# EAGLE design 1593K-WirelessTallyReceiver (EAGLE 9.4.2)
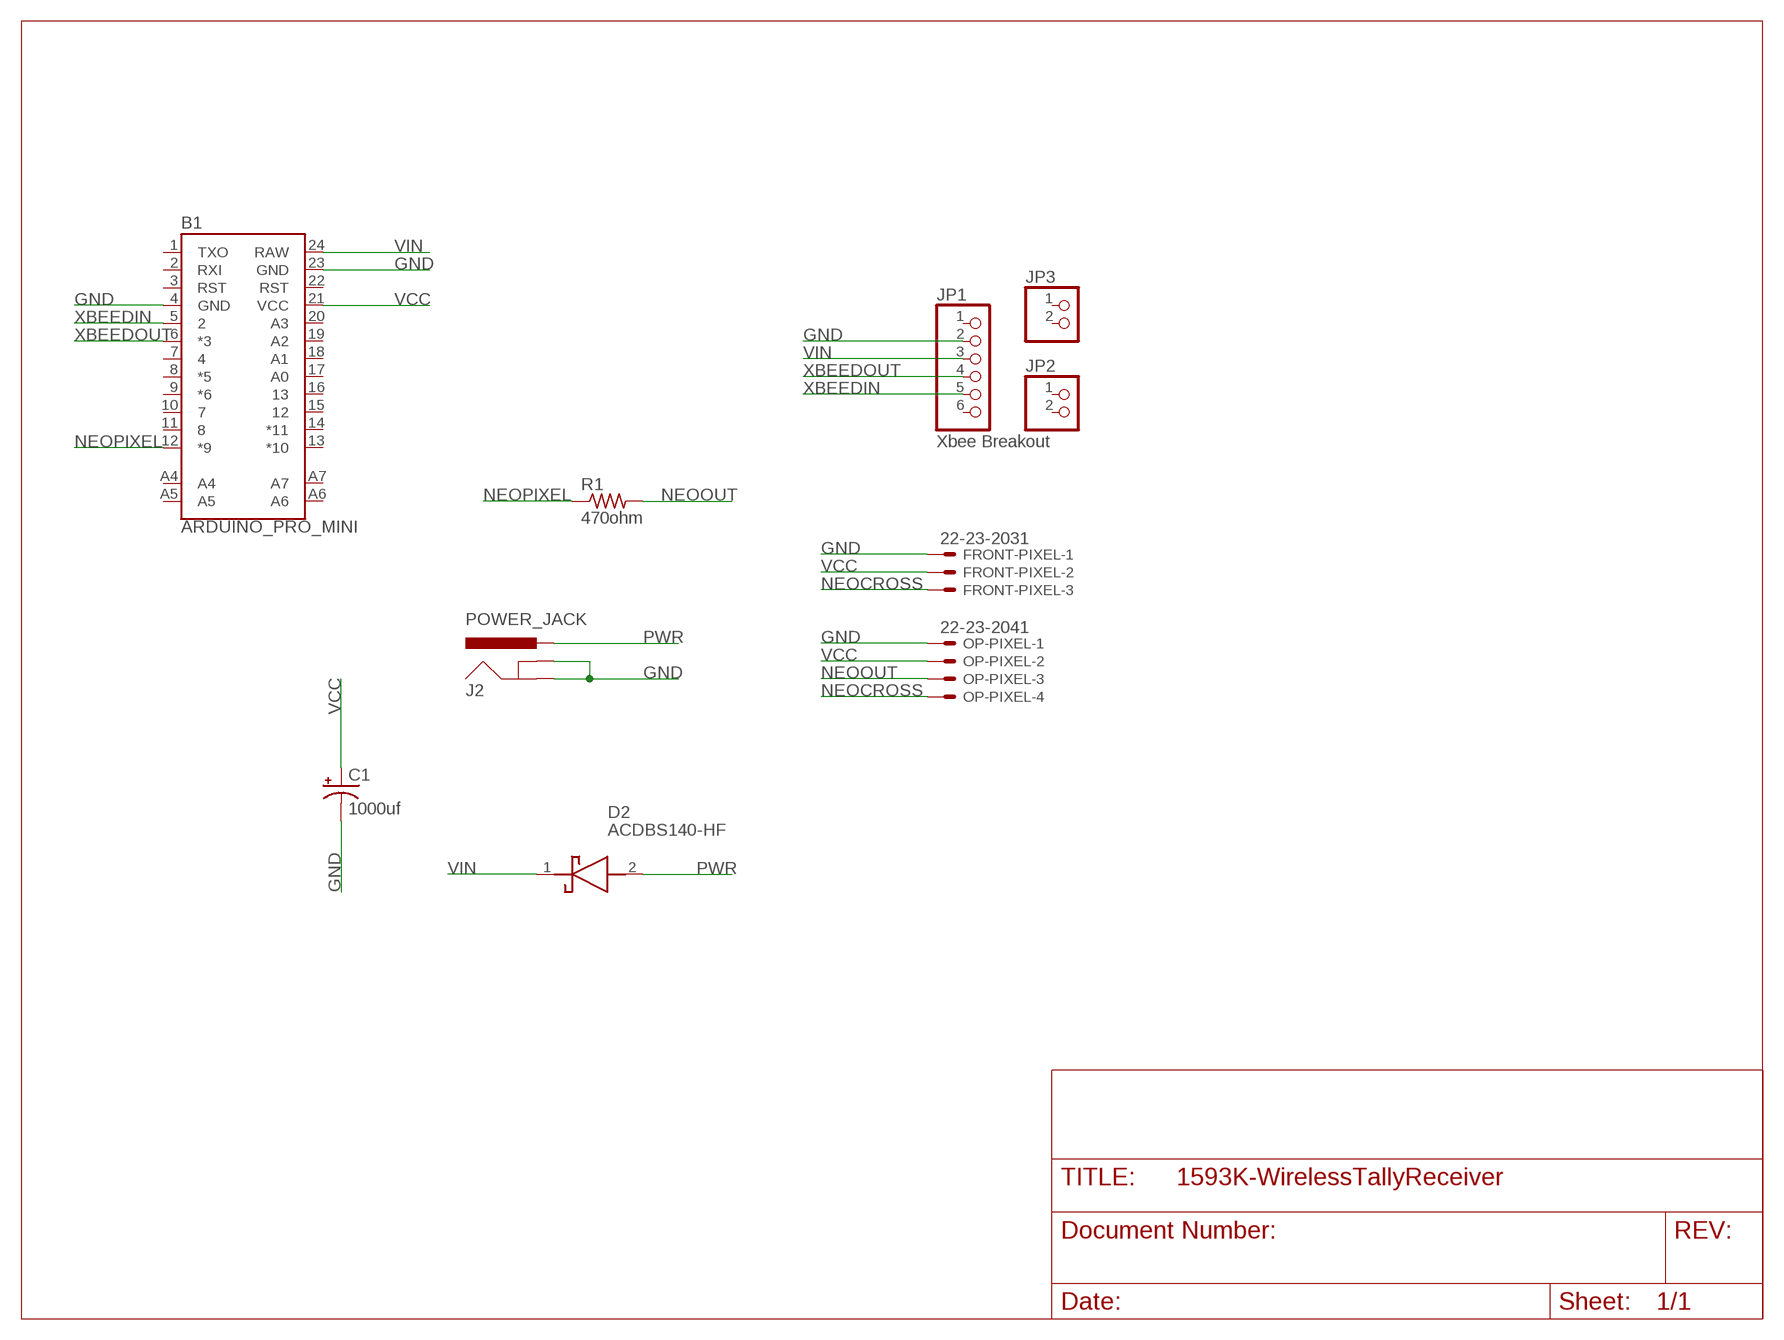
[diagram p0: schematic, sheet 1]

## Parts
B1  ARDUINO_PRO_MINI  [ARDUINO_PRO_MINI]
C1  1000uf  1000UF-RADIAL-5MM-25V-20%  [CPOL-RADIAL-5MM-10MM]
D2  ACDBS140-HF  [DIOM2013X100N]
FRONT-PIXEL  22-23-2031  [22-23-2031]
J2  POWER_JACK  [POWER_JACK_PTH]
JP1  Xbee Breakout  PINHD-1X6  [1X06]
JP2  PINHD-1X2  [1X02]
JP3  PINHD-1X2  [1X02]
OP-PIXEL  22-23-2041  [22-23-2041]
R1  470ohm  R-US_R0805  [R0805]

## Nets
GND: B1.4(GND) B1.23(GND) C1.- FRONT-PIXEL.1 J2.GND J2.GNDBREAK JP1.2 OP-PIXEL.1
NEOCROSS: FRONT-PIXEL.3 OP-PIXEL.4
NEOOUT: OP-PIXEL.3 R1.2
NEOPIXEL: B1.12(*9) R1.1
PWR: D2.2(A) J2.PWR
VCC: B1.21(VCC) C1.+ FRONT-PIXEL.2 OP-PIXEL.2
VIN: B1.24(RAW) D2.1(K) JP1.3
XBEEDIN: B1.5 JP1.5
XBEEDOUT: B1.6(*3) JP1.4
Unconnected: B1.1(TXO) B1.2(RXI) B1.3(RST) B1.7 B1.8(*5) B1.9(*6) B1.10 B1.11 B1.13(*10) B1.14(*11) B1.15 B1.16 B1.17(A0) B1.18(A1) B1.19(A2) B1.20(A3) B1.22(RST) B1.A4 B1.A5 B1.A6 B1.A7 JP1.1 JP1.6 JP2.1 JP2.2 JP3.1 JP3.2

## Library data of the parts
B1 = SparkFun-Boards:ARDUINO_PRO_MINI: SparkFun Pro Mini Pro Mini compatible footprint. Dimensions: 0.7 x 1.3" PCB Thickness: 0.8mm SparkFun Products: 3.3V/8MHz <https://www.sparkfun.com/products/11114> 5V/16MHz <https://www.sparkfun.com/products/11113>
C1 = SparkFun-Capacitors:1000UF: 1,000µF/1mF ceramic capacitors A capacitor is a passive two-terminal electrical component used to store electrical energy temporarily in an electric field. CAP-08070; PROD_ID: CAP-09538; VALUE: 1mF
D2 = SamacSys_Parts:ACDBS140-HF: Schottky Diodes & Rectifiers 40V 1A 0805 Source: Datasheet <https://componentsearchengine.com/Datasheets/1/ACDBS140-HF.pdf>; DESCRIPTION: Schottky Diodes & Rectifiers 40V 1A 0805; HEIGHT: 1mm; MANUFACTURER_NAME: Comchip Technology; MANUFACTURER_PART_NUMBER: ACDBS140-HF; MOUSER_PART_NUMBER: 750-ACDBS140-HF; MOUSER_PRICE-STOCK: https://www.mouser.com/Search/Refine.aspx?Keyword=750-ACDBS140-HF
FRONT-PIXEL = con-molex:22-23-2031: .100" (2.54mm) Center Header - 3 Pin; MF: MOLEX; MPN: 22-23-2031; OC_FARNELL: 1462950; OC_NEWARK: 30C0862
J2 = SparkFun-Connectors:POWER_JACK: Power Jack Connector This is the standard 5.5mm barrel jack for power. The PTH is the most common, proven, reliable, footprint. The Slot footprint only works if the mill layer is transmitted to the PCB fab house so be warned. Here are the connectors we sell at SparkFun: DC Barrel Power Jack/Connector <https://www.sparkfun.com/products/119> (PRT-00119) DC Barrel Power Jack/Connector (SMD) <https://www.sparkfun.com/products/12748> (PRT-12748) DC Barrel Jack Adapter - Breadboard Compatible <https://www.sparkfun.com/products/10811> (PRT-10811) It is used on this SparkFun product (and many, many others): SparkFun RedBoard - Programmed with Arduino <https://www.sparkfun.com/products/12757> (DEV-12757) Also, if you need a mating power supply or connector, please check these out: Wall Adapter Power Supply - 9VDC 650mA <https://www.sparkfun.com/products/298> (TOL-00298) DC Barrel Jack Adapter - Male <https://www.sparkfun.com/products/10287> (PRT-10287); PROD_ID: CONN-08197
JP1 = pinhead:PINHD-1X6: PIN HEADER
JP2 JP3 = pinhead:PINHD-1X2: PIN HEADER
OP-PIXEL = con-molex:22-23-2041: .100" (2.54mm) Center Header - 4 Pin; MF: MOLEX; MPN: 22-23-2041; OC_FARNELL: 1462920; OC_NEWARK: 38C0355
R1 = rcl:R-US_: RESISTOR, American symbol; SPICEPREFIX: R

## Board
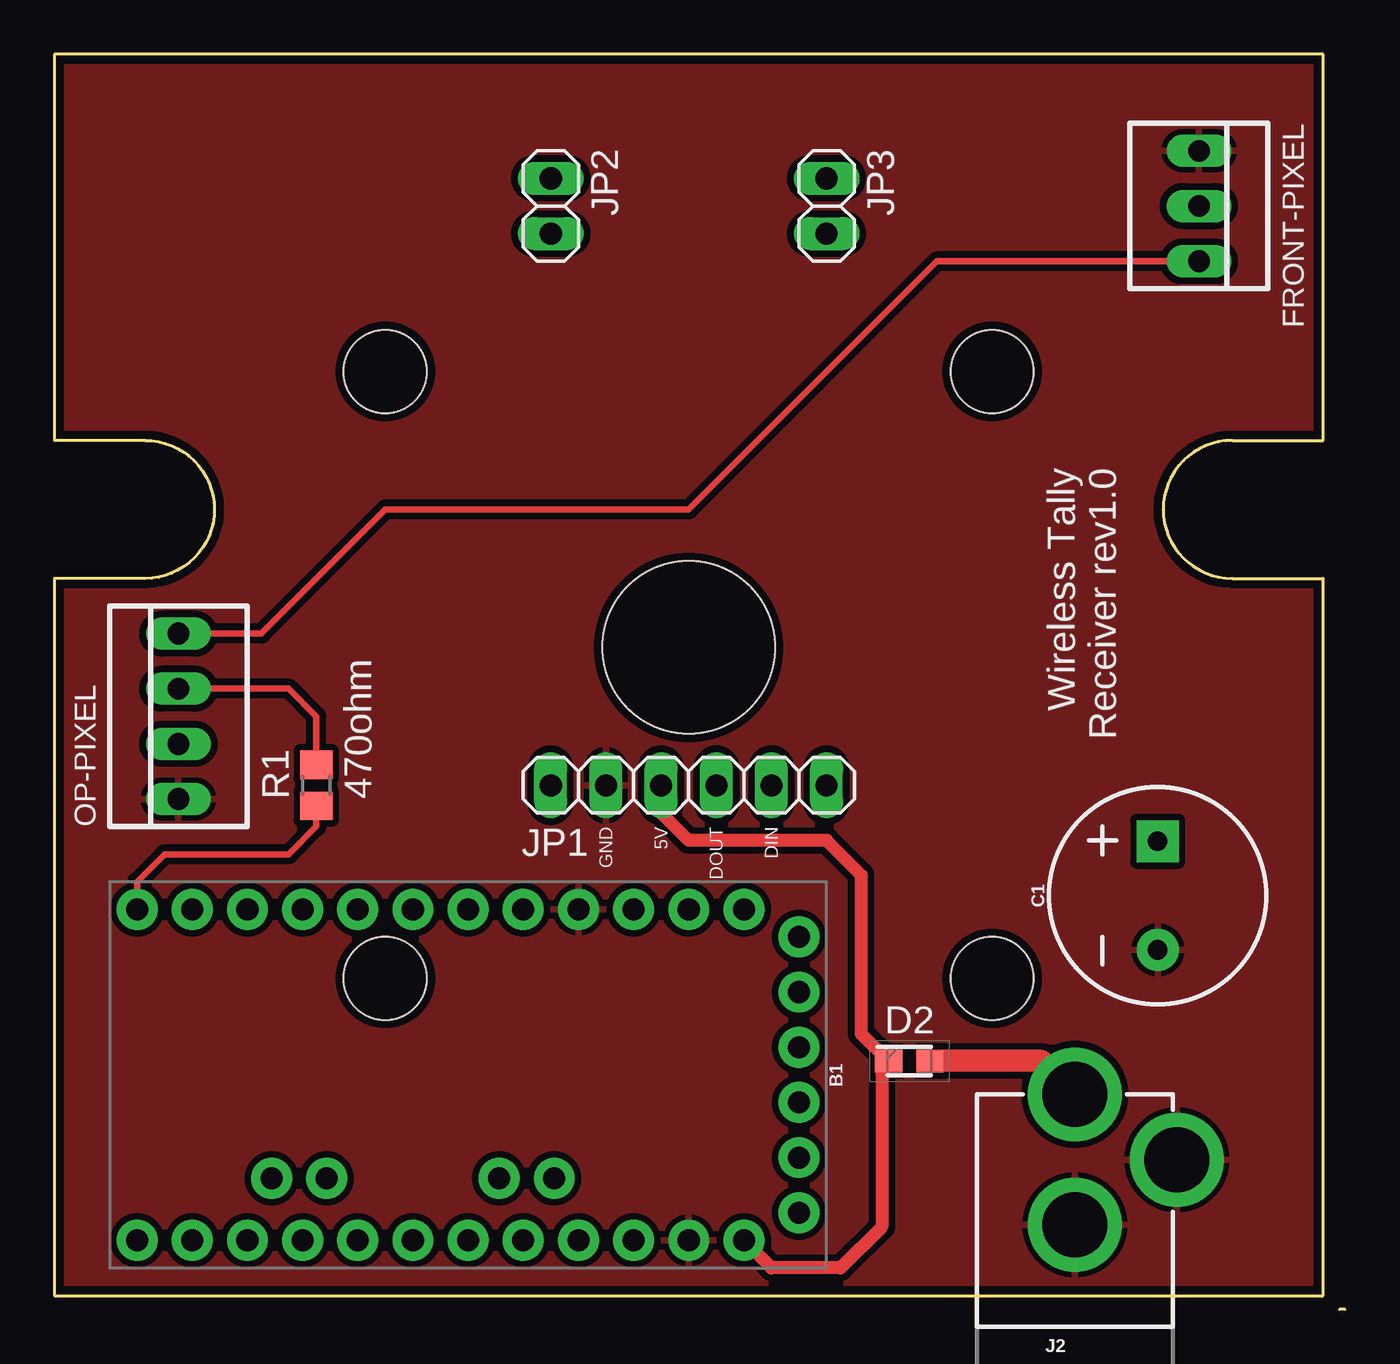
[diagram p1: board, top side]
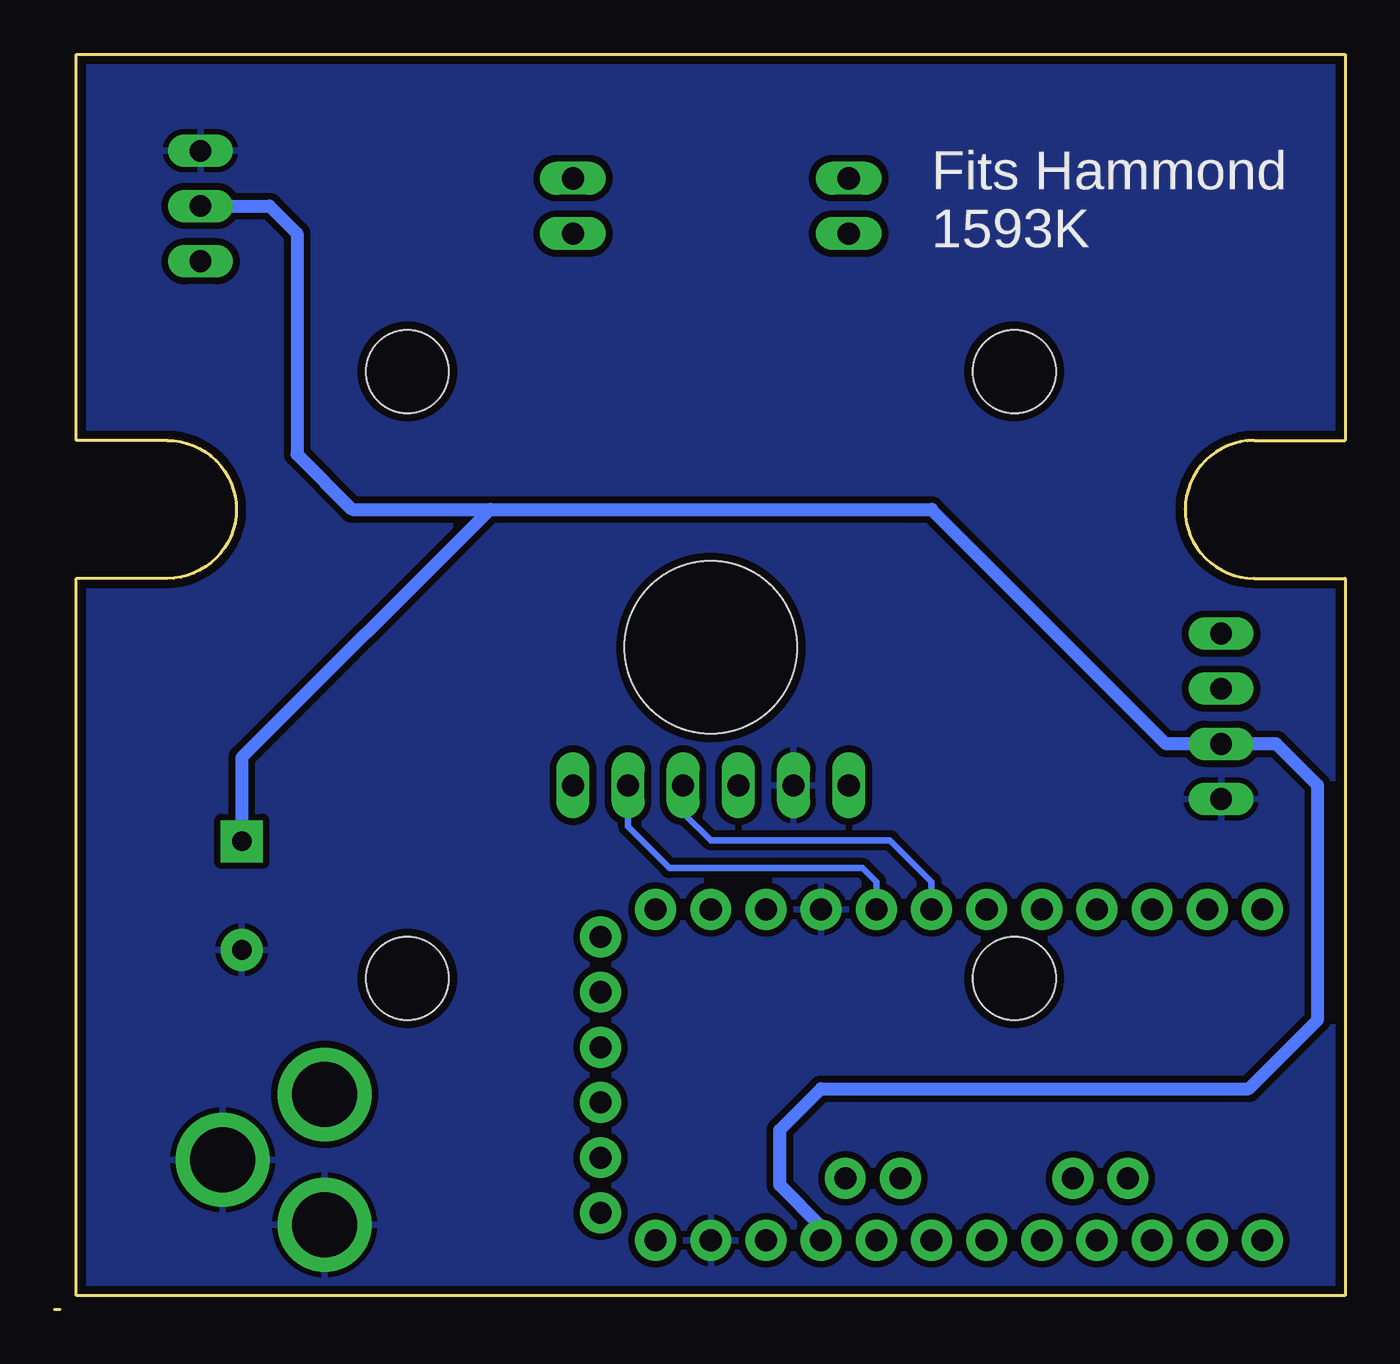
[diagram p2: board, bottom side, seen from below]

Size 59.44 x 57.78 mm. Coordinates in mm from the lower left corner, seen from the top.
Copper layers (1*16): Top 0.035559375mm / dielectric 1.6mm / Bottom 0.035559375mm
Design rules "default": minimum track width 6mil, minimum drill 10mil, track to track 6mil, track to pad 6mil, pad to pad 6mil, via to via 6mil, smd to smd 6mil, copper to edge 15mil, drill to drill 6mil, minimum pad ring 5mil, minimum via ring 5mil, stop-mask expansion 2.5mil, vias tented up to drill 0mil, thermal gap 10mil
Holes 7.94 mm at 29.21,30.48

### Footprints (pad centres in the part's own frame; a part is rotated, then mirrored left to right if it is on the bottom)
ARDUINO_PRO_MINI = drill 1.016 pad 1.88: 1 -7.62,12.7; 2 -7.62,10.16; 3 -7.62,7.62; 4 -7.62,5.08; 5 -7.62,2.54; 6 -7.62,0; 7 -7.62,-2.54; 8 -7.62,-5.08; 9 -7.62,-7.62; 10 -7.62,-10.16; 11 -7.62,-12.7; 12 -7.62,-15.24; 13 7.62,-15.24; 14 7.62,-12.7; 15 7.62,-10.16; 16 7.62,-7.62; 17 7.62,-5.08; 18 7.62,-2.54; 19 7.62,0; 20 7.62,2.54; 21 7.62,5.08; 22 7.62,7.62; 23 7.62,10.16; 24 7.62,12.7; A4 4.763,1.429; A5 4.763,3.969; A6 4.763,-9.049; A7 4.763,-6.509; BLK -6.35,15.24; GND -3.81,15.24; GRN 6.35,15.24; RXI 1.27,15.24; TXO 3.81,15.24; VCC -1.27,15.24
CPOL-RADIAL-5MM-10MM = drill 0.9 pad 1.93 square: + 2.5,0 | drill 0.9 pad 1.93: - -2.5,0
DIOM2013X100N = smd 1.25 x 1.05: 1 -0.95,0; 2 0.95,0
22-23-2031 = drill 1 long: 1 -2.54,0; 2 0,0; 3 2.54,0
POWER_JACK_PTH = drill 2.997 pad 4.318: GND 0,7.7; GNDBREAK 4.7,10.7; PWR 0,13.7
1X06 = drill 1.016 long: 1 -6.35,0; 2 -3.81,0; 3 -1.27,0; 4 1.27,0; 5 3.81,0; 6 6.35,0
1X02 = drill 1.016 long: 1 -1.27,0; 2 1.27,0
22-23-2041 = drill 1 long: 1 -3.81,0; 2 -1.27,0; 3 1.27,0; 4 3.81,0
R0805 = smd 1.3 x 1.5: 1 -0.95,0; 2 0.95,0
1593K = hole 3.81: -13.97,-13.97; -13.97,13.97; 13.97,13.97; 13.97,-13.97

### Placement (x,y rotation side)
B1  19.05,10.79 270 top
C1  50.8,19.05 90 top
D2  39.37,11.43 0 top
FRONT-PIXEL  52.7,50.8 270 top
J2  46.99,-3.81 0 top
JP1  29.21,24.13 0 top
JP2  22.86,50.8 270 top
JP3  35.56,50.8 270 top
OP-PIXEL  5.72,27.3 90 top
R1  12.07,24.13 90 top
U$1  [1593K]  29.21,29.21 0 top

### Tracks (layer width: path | path; a pad name or v marks a point on that pad's centre or on a via)
GND
  pour Top (isolate 0.305): -1.27,58.42 59.69,58.42 59.69,0 -1.27,0
  pour Bottom (isolate 0.305): -1.27,0 -1.27,58.42 59.69,58.42 59.69,5.08 60.96,3.81 60.96,0
NEOCROSS
  Top 0.305: OP-PIXEL.4 9.53,31.11 15.24,36.83 29.21,36.83 40.64,48.26 FRONT-PIXEL.3
NEOOUT
  Top 0.305: R1.2 12.07,27.3 10.79,28.57 OP-PIXEL.3
NEOPIXEL
  Top 0.305: B1.12 3.81,19.68 5.08,20.95 10.79,20.95 12.07,22.23 R1.1
PWR
  Top 1.016: J2.PWR 45.45,11.43 D2.2
VCC
  Bottom 0.61: B1.21 24.13,3.81 26.04,5.71 26.04,8.26 24.13,10.16 4.45,10.16 1.27,13.34 1.27,24.13 3.18,26.04 OP-PIXEL.2 8.26,26.04 19.05,36.83 39.37,36.83 | C1.+ 50.8,25.4 39.37,36.83 | FRONT-PIXEL.2 49.53,50.8 48.26,49.53 48.26,39.37 45.72,36.83 39.37,36.83
VIN
  Top 0.61: B1.24 33.02,1.91 36.2,1.91 38.1,3.81 38.1,11.11 D2.1 37.15,12.7 37.15,20 35.56,21.59 29.21,21.59 27.94,22.86 JP1.3
XBEEDIN
  Bottom 0.305: B1.5 21.59,19.68 22.23,20.32 31.11,20.32 33.02,22.23 JP1.5
XBEEDOUT
  Bottom 0.305: B1.6 19.05,19.68 20.96,21.59 29.21,21.59 30.48,22.86 JP1.4

### Text on the board
tNames: Wireless Tally / Receiver rev1.0 | GND | 5V | DOUT | DIN
bNames: Fits Hammond / 1593K